# Altium schematic sheet Sheet1.SchDoc
size A
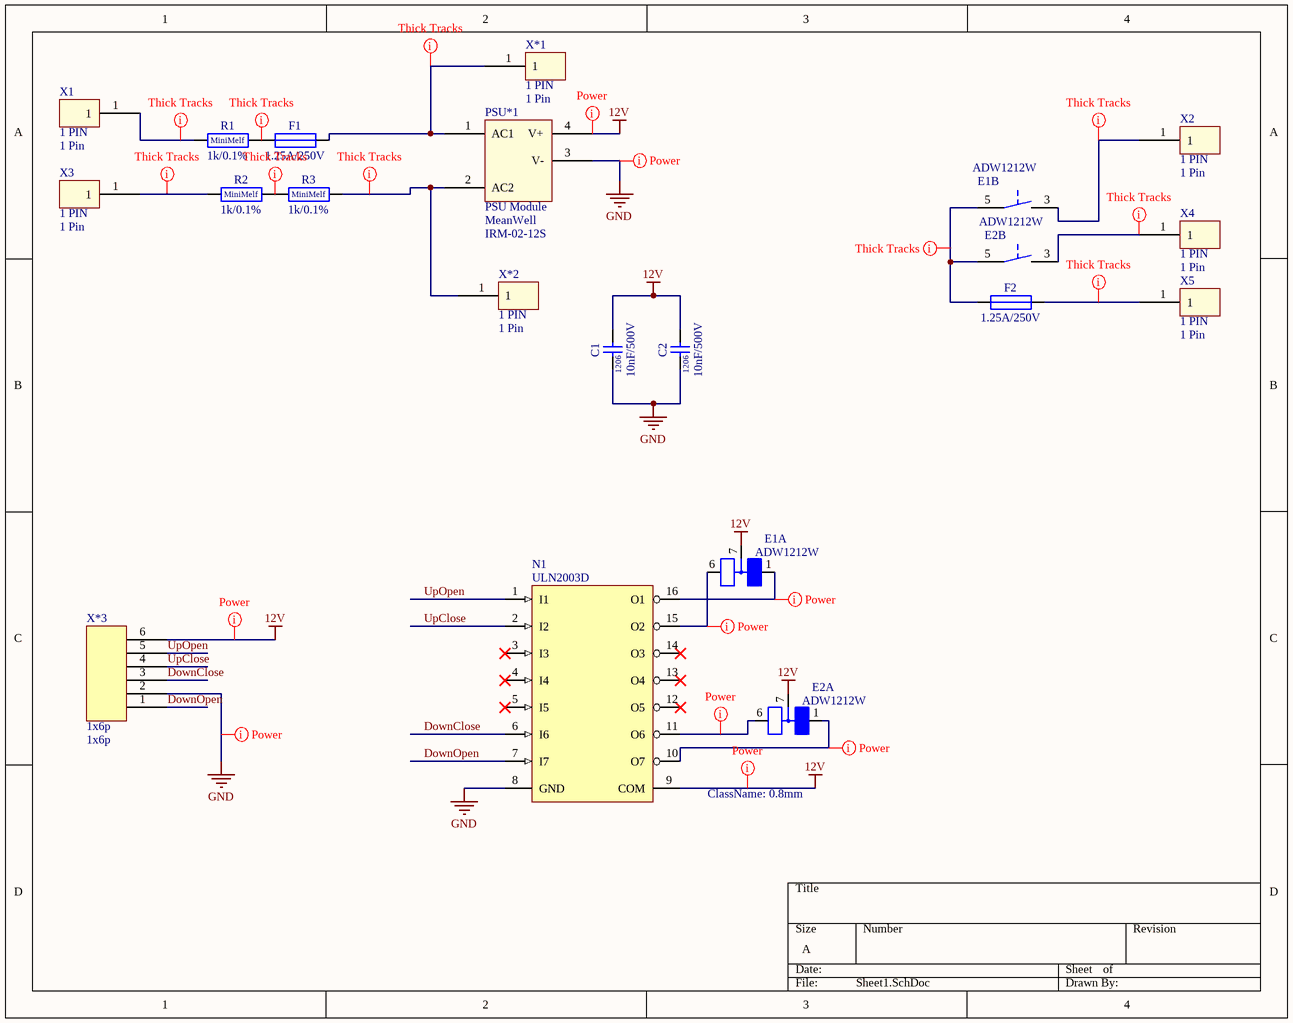
[diagram p0: Sheet1.SchDoc]

## Parts
C1  10nF/500V  [CAP_1206_IPC_B]
C2  10nF/500V  [CAP_1206_IPC_B]
E1  ADW1212W  [RELAIS_PANASONIC_ADW1212W]  (parts A,B of 2)
E2  ADW1212W  [RELAIS_PANASONIC_ADW1212W]  (parts A,B of 2)
F1  1.25A/250V  [Fuse]
F2  1.25A/250V  [Fuse]
N1  ULN2003D  [SOP127P720X175-16N]
PSU*1  PSU Module  Manufacturer: MeanWell  Manufacturer Code: IRM-02-12S  [RAC02-GB]
R1  1k/0.1%  [RES_MiniMELF_3514N]
R2  1k/0.1%  [RES_MiniMELF_3514N]
R3  1k/0.1%  [RES_MiniMELF_3514N]
X1  1 PIN  [1p]
X2  1 PIN  [1p]
X3  1 PIN  [1p]
X4  1 PIN  [1p]
X5  1 PIN  [1p]
X*1  1 PIN  [1p]
X*2  1 PIN  [1p]
X*3  1x6p  [M22-5330605]

## Nets
12V: C1.2 C2.2 E1.7(P) E2.7(P) N1.9(COM) PSU*1.4(V+) X*3.6
GND: C1.1 C2.1 N1.8(GND) PSU*1.3(V-) X*3.2
DownClose: N1.6(I6) X*3.3
DownOpen: N1.7(I7) X*3.1
UpClose: N1.2(I2) X*3.4
UpOpen: N1.1(I1) X*3.5
NetE1_1: E1.1(M) N1.16(O1)
NetE1_3: E1.3 X2.1
NetE1_5: E1.5 E2.5 F2.1
NetE1_6: E1.6(M1) N1.15(O2)
NetE2_1: E2.1(M) N1.10(O7)
NetE2_3: E2.3 X4.1
NetE2_6: E2.6(M1) N1.11(O6)
NetF1_1: F1.1 R1.2
NetF1_2: F1.2 PSU*1.1(AC1) X*1.1
NetF2_2: F2.2 X5.1
NetPSU*1_2: PSU*1.2(AC2) R3.2 X*2.1
NetR1_1: R1.1 X1.1
NetR2_1: R2.1 X3.1
NetR2_2: R2.2 R3.1

Not connected (* = marked no-connect by the designer): N1 3(I3)* 4(I4)* 5(I5)* 12(O5)* 13(O4)* 14(O3)*

## Layout directives
net class 2mm: NetE1_3, NetE1_5, NetE2_3, NetF1_1, NetF1_2, NetF2_2, NetPSU*1_2, NetR1_1, NetR2_1, NetR2_2
net class 0.8mm: 12V, GND, NetE1_1, NetE1_6, NetE2_1, NetE2_6

## Notes on the sheet
- (in symbol 1k_MiniMelf_01-3006) MiniMelf
- (in symbol 10nF_500V_1206_02-1257) 1206

## Library data of the parts
C1 C2 = 10nF_500V_1206_02-1257: 02-1257 - SMD Capacitor 1206 10nF 500V X7R; PcbLib: Capacitors SMT.PcbLib; Toleranz: 20%; Prüfstatus: geprüft; Published: 27.08.2014; Publisher: SS; PackageDescription: Capacitor SMD 1206; Partnumber: 02-1257; Spannung: 500V; Typ/Material: X7R; Value: 10nF
E1 E2 = ADW1212W_04-3960: 04-3960 - Relais, 12V, 1S 2Coils; PcbLib: Relais.PcbLib; Prüfstatus: zu prüfen; Partnumber: 04-3960; LatestRevisionDate: *; LatestRevisionNote: *; Publisher: SS; Published: 26.07.2013
F1 F2 = Fuse_1.25A_250V_04-3586: 04-3586 - Fuse 1.25A 250V THT 8.4x4mm RM5.08mm; PcbLib: Fuse.PcbLib; Prüfstatus: geprüft; Partnumber: 04-3586; LatestRevisionDate: *; LatestRevisionNote: *; Publisher: SS; Published: 04.04.2014; Strom: 1.25A
N1 = ULN2003D_11-0373: 11-0373- High-Voltage, High-Current Darlington Transistor Arrays, SOP16; PcbLib: SO, QSOP, MSOP.PcbLib; Prüfstatus: geprüft; Partnumber: 11-0373; LatestRevisionDate: *; LatestRevisionNote: *; Publisher: SS; Published: 22.07.2013; PackageDescription: SO16
PSU*1 = PSU Module: SMPS PCB Mode; Distribuitor: Mouser; Distribuitor Code: 709-IRM02-12S
R1-R3 = 1k_MiniMelf_01-3006: 01-3006 - SMD Resistor MiniMelf 0.25W 0.1%; Manufacturer / Manufacturer Name: Vishay-Beysc (F)# MMA 0204-15 0.1% B* 1K0; PcbLib: Resistors SMT.PcbLib; TCR: 15ppm; Prüfstatus: geprüft; Value: 1k; EX-relevant: EX; FuSi-relevant: FuSi; HelpURL: N:\data\Solutions\etw\Projekte\Bibliotheken\Bauteil-Neuanlagen\Datenblätter\01er-Parts\; Partnumber: 01-3006; LatestRevisionDate: *; LatestRevisionNote: *; Publisher: DD; Published: 26.11.2010; PackageDescription: SMD Resistor MiniMelf; Toleranz: 0.1%; Leistung: 0.25W
X*3 = 1x6p: Manufacturer: TI; Distribuitor: Mouser; Distribuitor Code: 926-LM3671MF-3.3NOPB; Manufacturer Code: 1x6p
X1-X5 X*1 X*2 = 1 PIN: 1: 1 Pin